# Altium project MailboxSensorV2.PrjPcb (part 1 of 4)
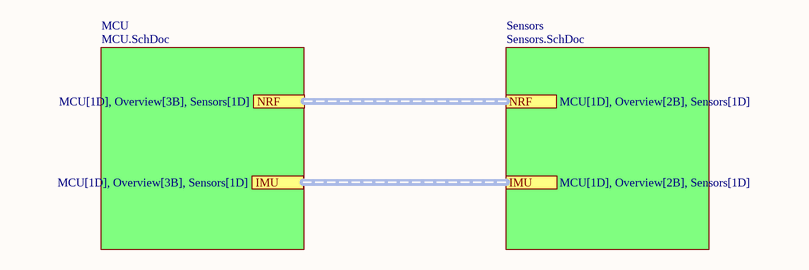
[diagram p0: Overview.SchDoc]
3 sheets, 65 parts. Net scope: flat (ports and power ports of the same name join across sheets).
Board file: MailboxSensorV2.PcbDoc
Sheets:
  Overview.SchDoc
    MCU = MCU.SchDoc
    Sensors = Sensors.SchDoc

## Sheet Overview.SchDoc
size A; SheetNumber: 1; SheetTotal: 3

### Sub-sheets
MCU = MCU.SchDoc: no entries
Sensors = Sensors.SchDoc: no entries

### Ports
IMU (harness IMU, see MCU[1D], Overview[2B], Sensors[1D]), IMU (harness IMU, see MCU[1D], Overview[3B], Sensors[1D]), NRF (harness NRF, see MCU[1D], Overview[2B], Sensors[1D]), NRF (harness NRF, see MCU[1D], Overview[3B], Sensors[1D])

## Sheet MCU.SchDoc
size A; SheetNumber: 2; SheetTotal: 3
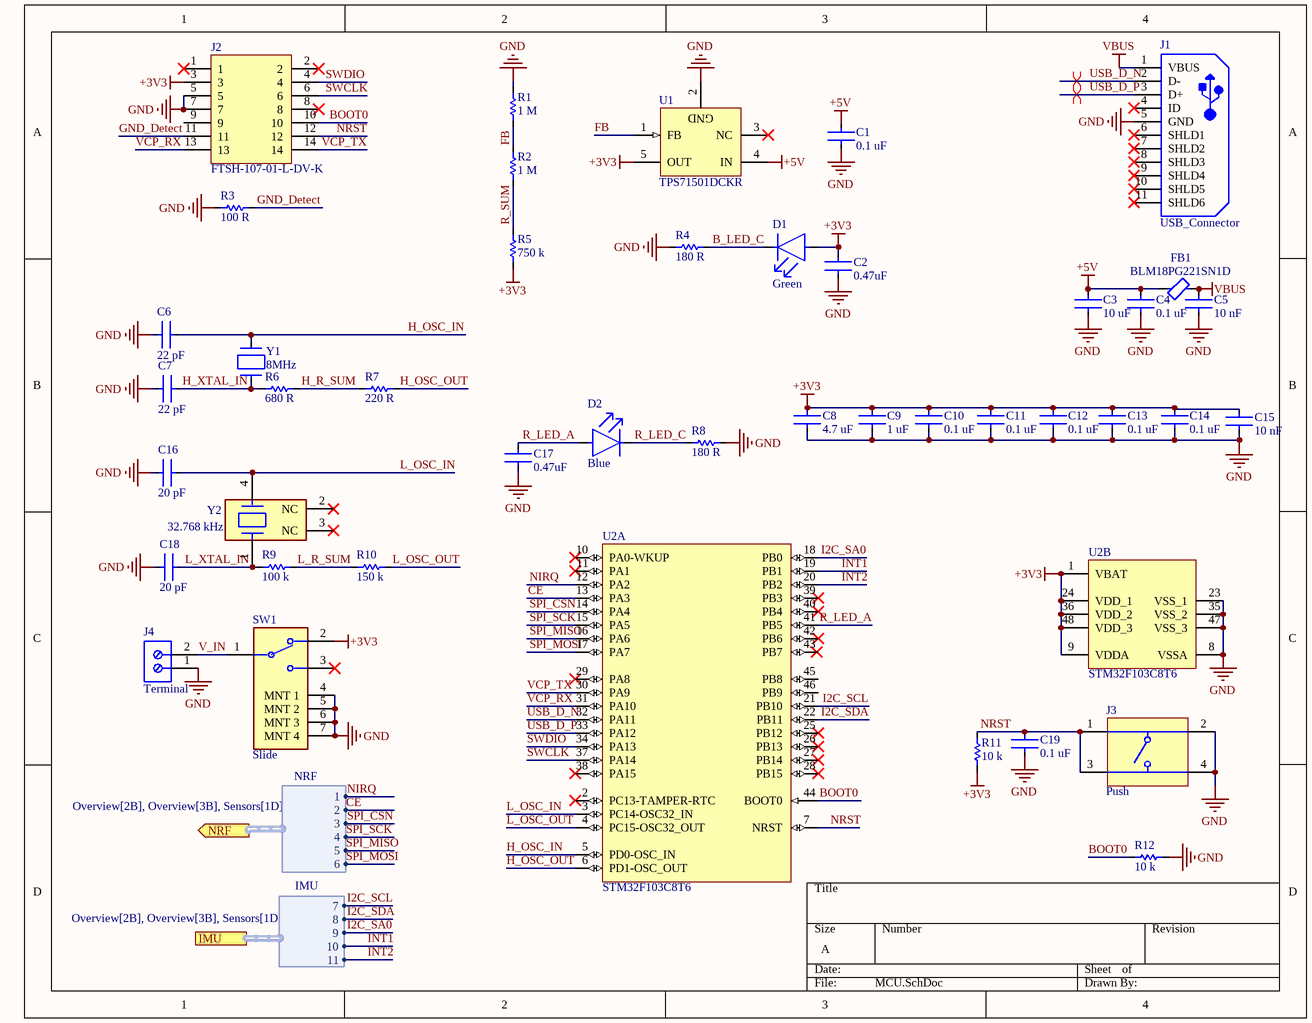
[diagram p1: MCU.SchDoc]

### Parts
C1  0.1 uF  [0_1uF_0603_Capacitor]
C2  0.47uF  [0_47uF_0603_Capacitor]
C3  10 uF  [10uF_0603_Capacitor]
C4  0.1 uF  [0_1uF_0603_Capacitor]
C5  10 nF  [10nF_0603_Capacitor]
C6  22 pF  [22pF_0603_Capacitor]
C7  22 pF  [22pF_0603_Capacitor]
C8  4.7 uF  [4_7uF_0603_Capacitor]
C9  1 uF  [1uF_0603_Capacitor]
C10  0.1 uF  [0_1uF_0603_Capacitor]
C11  0.1 uF  [0_1uF_0603_Capacitor]
C12  0.1 uF  [0_1uF_0603_Capacitor]
C13  0.1 uF  [0_1uF_0603_Capacitor]
C14  0.1 uF  [0_1uF_0603_Capacitor]
C15  10 nF  [10nF_0603_Capacitor]
C16  20 pF  [20pF_0603_Capacitor]
C17  0.47uF  [0_47uF_0603_Capacitor]
C18  20 pF  [20pF_0603_Capacitor]
C19  0.1 uF  [0_1uF_0603_Capacitor]
D1  Green  [Green_LED]
D2  Blue  [Blue_LED]
FB1  BLM18PG221SN1D  [Ferrite_Bead]
J1  USB_Connector  [MICRO_USB]
J2  FTSH-107-01-L-DV-K  [SWD_Header_Connector]
J3  Push  [Push_Button]
J4  Terminal  [Screw_Terminal]
R1  1 M  [1M_0603_Resistor]
R2  1 M  [1M_0603_Resistor]
R3  100 R  [100R_0603_Resistor]
R4  180 R  [180R_0603_Resistor]
R5  750 k  [750k_0603_Resistor]
R6  680 R  [680R_0603_Resistor]
R7  220 R  [220R_0603_Resistor]
R8  180 R  [180R_0603_Resistor]
R9  100 k  [100k_0603_Resistor]
R10  150 k  [150k_0603_Resistor]
R11  10 k  [10k_0603_Resistor]
R12  10 k  [10k_0603_Resistor]
SW1  Slide  [Slide_Switch]
U1  TPS71501DCKR  [5V_3V3_LDO]
U2  STM32F103C8T6  [STM32]  (parts A,B of 2)
Y1  8MHz  [8MHz_Oscillator]
Y2  32.768 kHz  [32_768MHz_Oscillator]

### Ports
IMU (harness IMU, see Overview[2B], Overview[3B], Sensors[1D]), NRF (out, harness NRF, see Overview[2B], Overview[3B], Sensors[1D])

### Harnesses
NRF: 1, 2, 3, 4, 5, 6
IMU: 7, 8, 9, 10, 11

### Nets
+3V3: C2.1 C8.1 C9.1 C10.1 C11.1 C12.1 C13.1 C14.1 C15.1 D1.2(A) J2.3 R5.1 R11.1 SW1.2 U1.5(OUT) U2.1(VBAT) U2.9(VDDA) U2.24(VDD_1) U2.36(VDD_2) U2.48(VDD_3)
+5V: C1.1 C3.1 C4.1 FB1.1 U1.4(IN)
GND: C1.2 C2.2 C3.2 C4.2 C5.2 C6.2 C7.2 C8.2 C9.2 C10.2 C11.2 C12.2 C13.2 C14.2 C15.2 C16.2 C17.2 C18.2 C19.2 J1.5(GND) J2.5 J2.7 J3.2 J3.4 J4.1 R1.2 R3.1 R4.1 R8.2 R12.1 SW1.4(MNT_1) SW1.5(MNT_2) SW1.6(MNT_3) SW1.7(MNT_4) U1.2(GND) U2.8(VSSA) U2.23(VSS_1) U2.35(VSS_2) U2.47(VSS_3)
VBUS: C5.1 FB1.2 J1.1(VBUS)
B_LED_C: D1.1(C) R4.2
BOOT0: J2.10 R12.2 U2.44(BOOT0)
CE: U2.13(PA3) ; port NRF.2
FB: R1.1 R2.2 U1.1(FB)
GND_Detect: J2.11 R3.2
H_OSC_IN: C6.1 U2.5(PD0-OSC_IN) Y1.2
H_OSC_OUT: R7.2 U2.6(PD1-OSC_OUT)
H_R_SUM: R6.2 R7.1
H_XTAL_IN: C7.1 R6.1 Y1.1
I2C_SA0: U2.18(PB0) ; port IMU.9
I2C_SCL: U2.21(PB10) ; port IMU.7
I2C_SDA: U2.22(PB11) ; port IMU.8
INT1: U2.19(PB1) ; port IMU.10
INT2: U2.20(PB2) ; port IMU.11
L_OSC_IN: C16.1 U2.3(PC14-OSC32_IN) Y2.4
L_OSC_OUT: R10.2 U2.4(PC15-OSC32_OUT)
L_R_SUM: R9.2 R10.1
L_XTAL_IN: C18.1 R9.1 Y2.1
NIRQ: U2.12(PA2) ; port NRF.1
NRST: C19.1 J2.12 J3.1 J3.3 R11.2 U2.7(NRST)
R_LED_A: C17.1 D2.2(A) U2.41(PB5)
R_LED_C: D2.1(C) R8.1
R_SUM: R2.1 R5.2
SPI_CSN: U2.14(PA4) ; port NRF.3
SPI_MISO: U2.16(PA6) ; port NRF.5
SPI_MOSI: U2.17(PA7) ; port NRF.6
SPI_SCK: U2.15(PA5) ; port NRF.4
SWCLK: J2.6 U2.37(PA14)
SWDIO: J2.4 U2.34(PA13)
USB_D_N: J1.2(D-) U2.32(PA11)
USB_D_P: J1.3(D+) U2.33(PA12)
V_IN: J4.2 SW1.1
VCP_RX: J2.13 U2.31(PA10)
VCP_TX: J2.14 U2.30(PA9)

Not connected (* = marked no-connect by the designer): J1 4(ID)* 6(SHLD1)* 7(SHLD2)* 8(SHLD3)* 9(SHLD4)* 10(SHLD5)* 11(SHLD6)*; J2 1* 2* 8* 9; SW1 3*; U1 3(NC)*; U2 2(PC13-TAMPER-RTC)* 10(PA0-WKUP)* 11(PA1)* 25(PB12)* 26(PB13)* 27(PB14)* 28(PB15)* 29(PA8)* 38(PA15)* 39(PB3)* 40(PB4)* 42(PB6)* 43(PB7) 45(PB8) 46(PB9); Y2 2(NC)* 3(NC)*

### Layout directives
differential pair: USB_D_N, USB_D_P